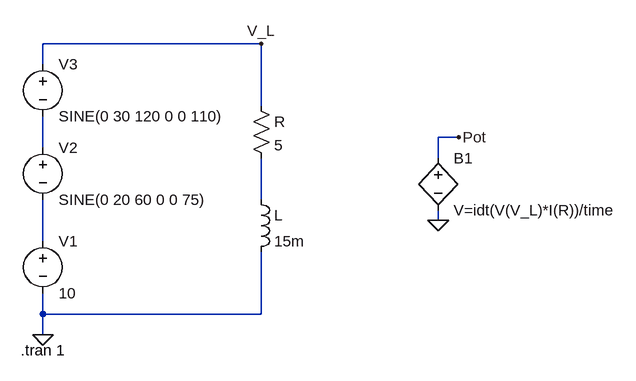
[diagram p0: schematic Atv1p3.asc]
Atv1p3.asc, the LTspice schematic file:
Version 4
SHEET 1 880 680
WIRE 240 -96 -96 -96
WIRE -96 -64 -96 -96
WIRE 240 0 240 -96
WIRE 544 48 512 48
WIRE -96 64 -96 16
WIRE 512 80 512 48
WIRE 240 144 240 80
WIRE 512 176 512 160
WIRE -96 208 -96 144
WIRE -96 320 -96 288
WIRE 240 320 240 224
WIRE 240 320 -96 320
WIRE -96 352 -96 320
FLAG -96 352 0
FLAG 512 176 0
FLAG 544 48 Pot
FLAG 240 -96 V_L
SYMBOL voltage -96 192 R0
SYMATTR InstName V1
SYMATTR Value 10
SYMBOL voltage -96 48 R0
WINDOW 123 0 0 Left 0
WINDOW 39 0 0 Left 0
SYMATTR InstName V2
SYMATTR Value SINE(0 20 60 0 0 75)
SYMBOL voltage -96 -80 R0
WINDOW 123 0 0 Left 0
WINDOW 39 0 0 Left 0
SYMATTR InstName V3
SYMATTR Value SINE(0 30 120 0 0 110)
SYMBOL res 224 -16 R0
SYMATTR InstName R
SYMATTR Value 5
SYMBOL ind 224 128 R0
SYMATTR InstName L
SYMATTR Value 15m
SYMBOL bv 512 64 R0
SYMATTR InstName B1
SYMATTR Value V=idt(V(V_L)*I(R))/time
TEXT -130 376 Left 2 !.tran 1

The netlist it stands for:
* Atv1p3.asc
V1 N003 0 10
V2 N001 N003 SINE(0 20 60 0 0 75)
V3 V_L N001 SINE(0 30 120 0 0 110)
R V_L N002 5
L N002 0 15m
B1 Pot 0 V=idt(V(V_L)*I(R))/time
.tran 1
.backanno
.end